# EAGLE design scenes bus (EAGLE 7.4.0)
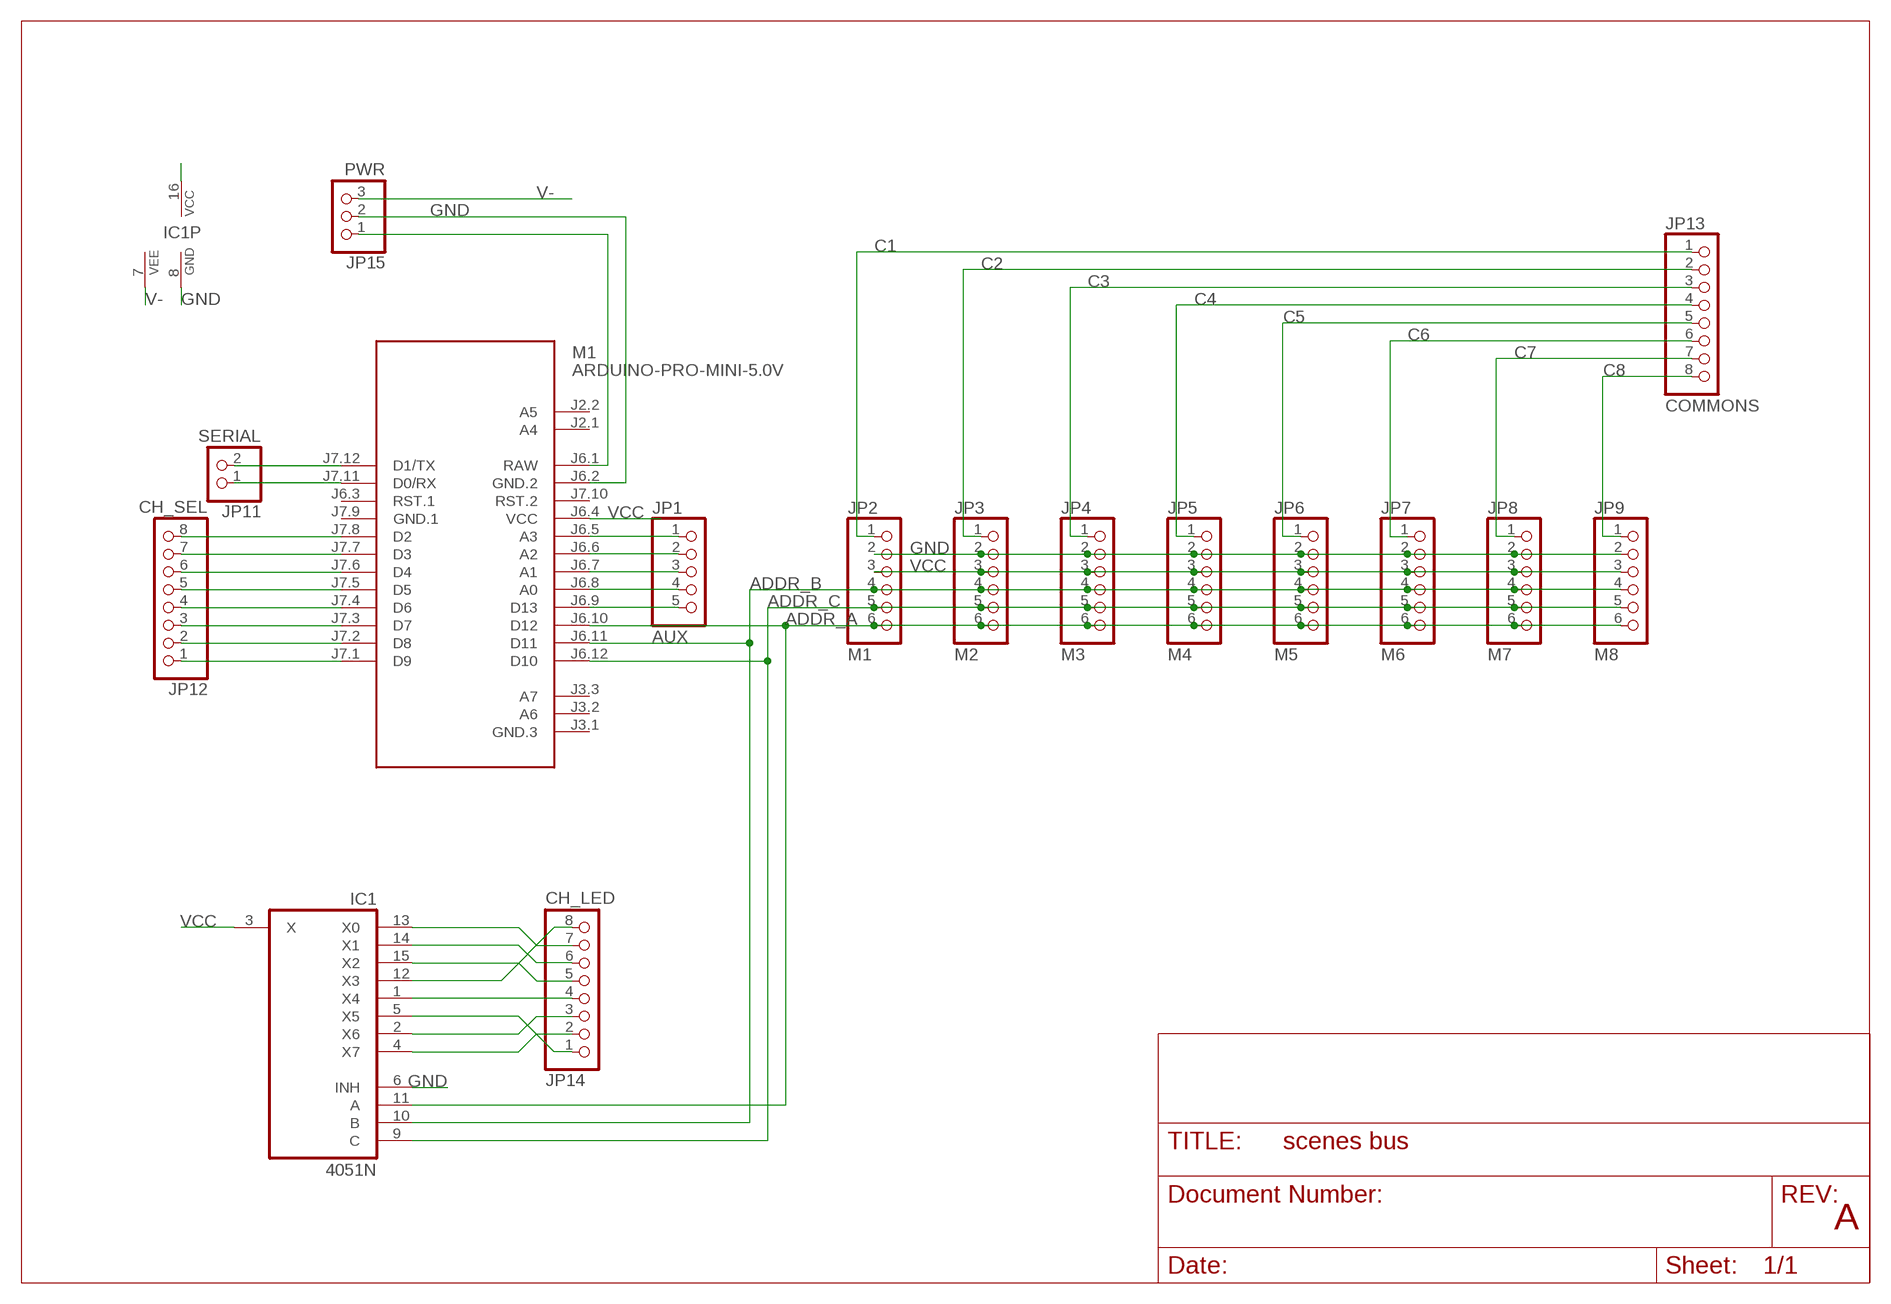
[diagram p0: schematic, sheet 1]

## Parts
IC1  4051N  [DIL16]
JP1  AUX  PINHD-1X5  [1X05]
JP2  M1  PINHD-1X6  [1X06]
JP3  M2  PINHD-1X6  [1X06]
JP4  M3  PINHD-1X6  [1X06]
JP5  M4  PINHD-1X6  [1X06]
JP6  M5  PINHD-1X6  [1X06]
JP7  M6  PINHD-1X6  [1X06]
JP8  M7  PINHD-1X6  [1X06]
JP9  M8  PINHD-1X6  [1X06]
JP11  SERIAL  PINHD-1X2  [1X02]
JP12  CH_SEL  PINHD-1X8  [1X08]
JP13  COMMONS  PINHD-1X8  [1X08]
JP14  CH_LED  PINHD-1X8  [1X08]
JP15  PWR  PINHD-1X3  [1X03]
M1  ARDUINO-PRO-MINI-5.0V  ARDUINO-PRO-MINI-5.0V#NP  [ARDUINO-PRO-MINI#NP]

## Nets
ADDR_A: IC1.11(A) JP2.6 JP3.6 JP4.6 JP5.6 JP6.6 JP7.6 JP8.6 JP9.6 M1.J6.10(D12)
ADDR_B: IC1.10(B) JP2.4 JP3.4 JP4.4 JP5.4 JP6.4 JP7.4 JP8.4 JP9.4 M1.J6.11(D11)
ADDR_C: IC1.9(C) JP2.5 JP3.5 JP4.5 JP5.5 JP6.5 JP7.5 JP8.5 JP9.5 M1.J6.12(D10)
C1: JP2.1 JP13.1
C2: JP3.1 JP13.2
C3: JP4.1 JP13.3
C4: JP5.1 JP13.4
C5: JP6.1 JP13.5
C6: JP7.1 JP13.6
C7: JP8.1 JP13.7
C8: JP9.1 JP13.8
GND: IC1.6(INH) IC1.8(GND) JP2.2 JP3.2 JP4.2 JP5.2 JP6.2 JP7.2 JP8.2 JP9.2 JP15.2 M1.J6.2(GND.2)
N$1: JP1.1 M1.J6.5(A3)
N$2: JP1.2 M1.J6.6(A2)
N$3: JP1.3 M1.J6.7(A1)
N$4: JP1.4 M1.J6.8(A0)
N$5: JP1.5 M1.J6.9(D13)
N$14: JP12.1 M1.J7.1(D9)
N$15: JP12.2 M1.J7.2(D8)
N$16: JP12.3 M1.J7.3(D7)
N$17: JP12.4 M1.J7.4(D6)
N$18: JP12.5 M1.J7.5(D5)
N$19: JP12.6 M1.J7.6(D4)
N$20: JP12.7 M1.J7.7(D3)
N$21: JP12.8 M1.J7.8(D2)
N$23: IC1.1(X4) JP14.4
N$24: IC1.2(X6) JP14.3
N$25: JP11.2 M1.J7.12(D1/TX)
N$26: JP11.1 M1.J7.11(D0/RX)
N$27: IC1.4(X7) JP14.2
N$28: IC1.5(X5) JP14.1
N$30: JP15.1 M1.J6.1(RAW)
N$31: IC1.15(X2) JP14.5
N$32: IC1.14(X1) JP14.6
N$33: IC1.13(X0) JP14.7
N$34: IC1.12(X3) JP14.8
V-: IC1.7(VEE) JP15.3
VCC: IC1.3(X) IC1.16(VCC) JP2.3 JP3.3 JP4.3 JP5.3 JP6.3 JP7.3 JP8.3 JP9.3 M1.J6.4(VCC)
Unconnected: M1.J2.1(A4) M1.J2.2(A5) M1.J3.1(GND.3) M1.J3.2(A6) M1.J3.3(A7) M1.J6.3(RST.1) M1.J7.10(RST.2)

## Notes on the sheet
- A

## Power pins joined to a net without a drawn wire
GND.1: M1.J7.9(GND.1)

## Library data of the parts
IC1 = 40xx:4051: 8-channel ANALOG MULTIPLEXER
JP1 = pinhead:PINHD-1X5: PIN HEADER
JP2-JP9 = pinhead:PINHD-1X6: PIN HEADER
JP11 = pinhead:PINHD-1X2: PIN HEADER
JP12-JP14 = pinhead:PINHD-1X8: PIN HEADER
JP15 = pinhead:PINHD-1X3: PIN HEADER
M1 = diy-modules:ARDUINO-PRO-MINI-*#NP: Arduino Pro Mini (and compatible devices) without programming pads More details available here: https://www.arduino.cc/en/Main/ArduinoBoardProMini Click here to find device on ebay.com <http://www.ebay.com/sch/arduino+pro+mini>

## Board
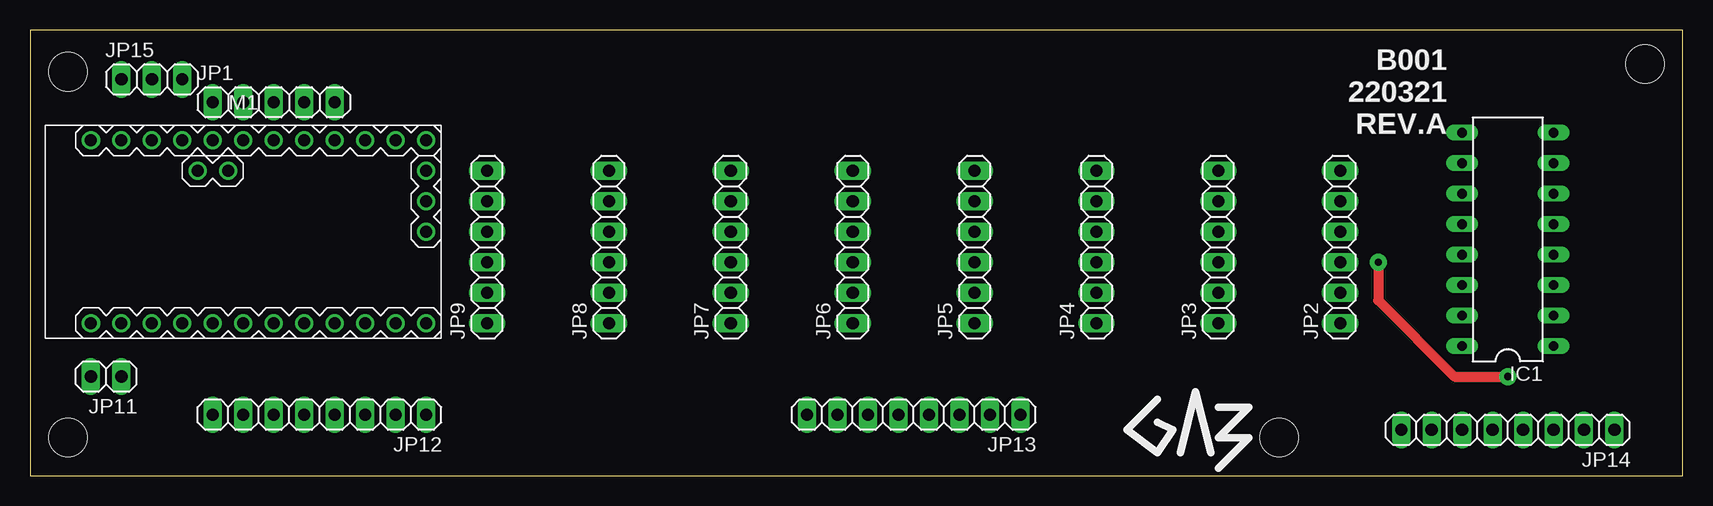
[diagram p1: board, top side]
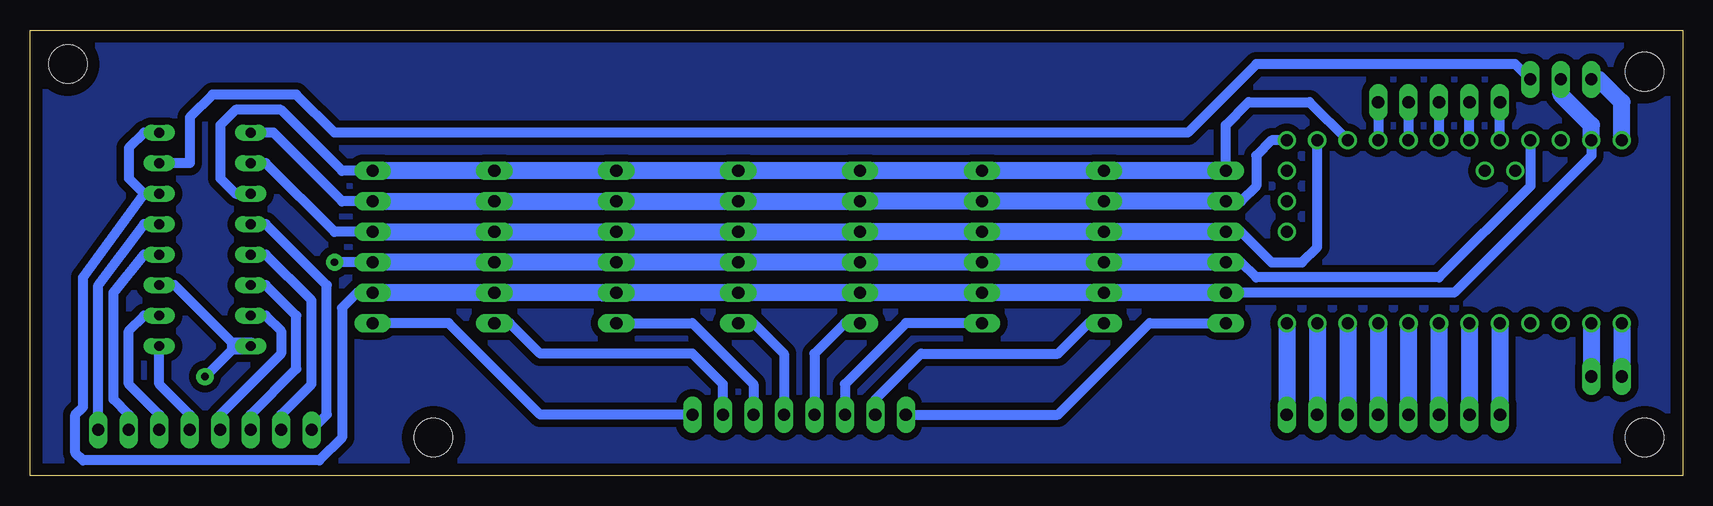
[diagram p2: board, bottom side, seen from below]

Size 137.78 x 37.13 mm. Coordinates in mm from the lower left corner, seen from the top.
Outline: 0,0 137.78,0 137.78,37.13 0,37.13 0,0
Copper layers (1*16): Top 0.035mm / dielectric 1.5mm / Bottom 0.035mm
Design rules "default": minimum track width 10mil, minimum drill 24mil, track to track 8mil, track to pad 8mil, pad to pad 8mil, via to via 8mil, smd to smd 8mil, copper to edge 40mil, drill to drill 8mil, minimum pad ring 10mil, minimum via ring 8mil, stop-mask expansion 4mil, vias tented up to drill 0mil, thermal gap 10mil
Holes 3.2 mm at 3.17,3.17 134.62,34.29 3.17,33.66 104.14,3.17

### Footprints (pad centres in the part's own frame; a part is rotated, then mirrored left to right if it is on the bottom)
DIL16 = drill 0.813 long: 1 -8.89,-3.81; 2 -6.35,-3.81; 3 -3.81,-3.81; 4 -1.27,-3.81; 5 1.27,-3.81; 6 3.81,-3.81; 7 6.35,-3.81; 8 8.89,-3.81; 9 8.89,3.81; 10 6.35,3.81; 11 3.81,3.81; 12 1.27,3.81; 13 -1.27,3.81; 14 -3.81,3.81; 15 -6.35,3.81; 16 -8.89,3.81
1X05 = drill 1.016 long: 1 -5.08,0; 2 -2.54,0; 3 0,0; 4 2.54,0; 5 5.08,0
1X06 = drill 1.016 long: 1 -6.35,0; 2 -3.81,0; 3 -1.27,0; 4 1.27,0; 5 3.81,0; 6 6.35,0
1X02 = drill 1.016 long: 1 -1.27,0; 2 1.27,0
1X08 = drill 1.016 long: 1 -8.89,0; 2 -6.35,0; 3 -3.81,0; 4 -1.27,0; 5 1.27,0; 6 3.81,0; 7 6.35,0; 8 8.89,0
1X03 = drill 1.016 long: 1 -2.54,0; 2 0,0; 3 2.54,0
ARDUINO-PRO-MINI#NP = drill 1: J2.1 -1.27,5.08; J2.2 -3.81,5.08; J3.1 15.24,0; J3.2 15.24,2.54; J3.3 15.24,5.08; J6.1 -12.7,7.62; J6.2 -10.16,7.62; J6.3 -7.62,7.62; J6.4 -5.08,7.62; J6.5 -2.54,7.62; J6.6 0,7.62; J6.7 2.54,7.62; J6.8 5.08,7.62; J6.9 7.62,7.62; J6.10 10.16,7.62; J6.11 12.7,7.62; J6.12 15.24,7.62; J7.1 15.24,-7.62; J7.2 12.7,-7.62; J7.3 10.16,-7.62; J7.4 7.62,-7.62; J7.5 5.08,-7.62; J7.6 2.54,-7.62; J7.7 0,-7.62; J7.8 -2.54,-7.62; J7.9 -5.08,-7.62; J7.10 -7.62,-7.62; J7.11 -10.16,-7.62; J7.12 -12.7,-7.62

### Placement (x,y rotation side)
IC1  123.19,19.68 90 top
JP1  20.32,31.11 0 top
JP2  109.22,19.05 90 top
JP3  99.06,19.05 90 top
JP4  88.9,19.05 90 top
JP5  78.74,19.05 90 top
JP6  68.58,19.05 90 top
JP7  58.42,19.05 90 top
JP8  48.26,19.05 90 top
JP9  38.1,19.05 90 top
JP11  6.35,8.26 180 top
JP12  24.13,5.08 180 top
JP13  73.66,5.08 180 top
JP14  123.19,3.81 180 top
JP15  10.16,33.02 0 top
M1  17.78,20.32 0 top

### Tracks (layer width: path | path; a pad name or v marks a point on that pad's centre or on a via)
ADDR_A
  Bottom 0.813: JP9.6 38.1,29.21 36.2,31.11 31.11,31.11 M1.J6.10 | JP2.6 111.76,25.4 116.84,30.48 120.65,30.48 121.92,29.21 121.92,24.77 120.65,23.5 IC1.11
  Bottom 1.422: JP9.6 JP8.6 JP7.6 JP6.6 JP5.6 JP4.6 JP3.6 JP2.6
ADDR_B
  Bottom 0.813: JP9.4 36.83,20.32 34.29,17.78 31.75,17.78 30.48,19.05 M1.J6.11 | JP2.4 112.39,20.32 118.11,26.04 IC1.10
  Bottom 1.422: JP9.4 JP8.4 JP7.4 JP6.4 JP5.4 JP4.4 JP3.4 JP2.4
ADDR_C
  Bottom 0.813: M1.J6.12 34.29,27.94 35.56,26.67 35.56,24.13 36.83,22.86 JP9.5 | JP2.5 111.76,22.86 117.47,28.57 IC1.9
  Bottom 1.422: JP9.5 JP8.5 JP7.5 JP6.5 JP5.5 JP4.5 JP3.5 JP2.5
C1
  Bottom 0.813: JP13.1 95.25,5.08 102.87,12.7 JP2.1
C2
  Bottom 0.813: JP13.2 80.01,7.62 82.55,10.16 95.25,10.16 97.79,12.7 JP3.1
C3
  Bottom 0.813: JP4.1 82.55,12.7 77.47,7.62 JP13.3
C4
  Bottom 0.813: JP5.1 77.47,12.7 74.93,10.16 JP13.4
C5
  Bottom 0.813: JP6.1 69.85,12.7 72.39,10.16 JP13.5
C6
  Bottom 0.813: JP7.1 64.77,12.7 69.85,7.62 JP13.6
C7
  Bottom 0.813: JP13.7 67.31,6.35 63.5,10.16 52.07,10.16 49.53,12.7 JP8.1
C8
  Bottom 0.813: JP13.8 52.07,5.08 44.45,12.7 JP9.1
GND
  Bottom 0.813: M1.J6.2 7.62,26.67 19.05,15.24 JP9.2 | IC1.8 128.27,28.57 129.54,27.3 129.54,24.77 128.27,23.5 | 128.27,23.5 IC1.6 | JP2.2 110.49,15.24 111.76,13.97 111.76,3.17 113.67,1.27 133.35,1.27 133.99,1.91 133.99,5.08 133.35,5.71 133.35,16.51 128.27,23.5
  Bottom 1.422: JP9.2 JP8.2 JP7.2 JP6.2 JP5.2 JP4.2 | 90.17,15.24 JP4.2 | JP4.2 JP3.2 JP2.2 | M1.J6.2 7.62,29.21 10.16,31.75 JP15.2
N$1
  Bottom 0.813: M1.J6.5 JP1.1
N$2
  Bottom 0.813: M1.J6.6 JP1.2
N$3
  Bottom 0.813: JP1.3 M1.J6.7
N$4
  Bottom 0.813: JP1.4 M1.J6.8
N$5
  Bottom 0.813: JP1.5 M1.J6.9
N$6
  pour Bottom (isolate 0.61): 0,36.83 137.79,36.83 137.79,0 0,0
N$14
  Bottom 1.422: M1.J7.1 JP12.1
N$15
  Bottom 1.422: M1.J7.2 JP12.2
N$16
  Bottom 1.422: M1.J7.3 JP12.3
N$17
  Bottom 1.422: M1.J7.4 JP12.4
N$18
  Bottom 1.422: M1.J7.5 JP12.5
N$19
  Bottom 1.422: M1.J7.6 JP12.6
N$20
  Bottom 1.422: M1.J7.7 JP12.7
N$21
  Bottom 1.422: M1.J7.8 JP12.8
N$23
  Bottom 0.813: JP14.4 124.46,5.08 127,7.62 IC1.1
N$24
  Bottom 0.813: JP14.3 127,5.08 129.54,7.62 129.54,12.06 128.27,13.34 IC1.2
N$25
  Bottom 1.422: M1.J7.12 JP11.2
N$26
  Bottom 1.422: M1.J7.11 JP11.1
N$27
  Bottom 0.813: JP14.2 129.54,5.08 130.81,6.35 130.81,15.24 128.27,18.41 IC1.4
N$28
  Bottom 0.813: JP14.1 132.08,15.88 128.27,20.95 IC1.5
N$30
  Bottom 1.422: M1.J6.1 5.08,31.11 6.99,33.02 JP15.1
N$31
  Bottom 0.813: IC1.15 118.11,13.34 116.84,12.06 116.84,10.16 121.92,5.08 JP14.5
N$32
  Bottom 0.813: JP14.6 119.38,5.08 115.57,8.89 115.57,13.34 118.11,15.88 IC1.14
N$33
  Bottom 0.813: JP14.7 116.84,5.08 114.3,7.62 114.3,14.61 118.11,18.41 IC1.13
N$34
  Bottom 0.813: JP14.8 113.03,5.08 113.03,15.88 118.11,20.95 IC1.12
V-
  Bottom 0.813: JP15.3 13.97,34.29 35.56,34.29 41.27,28.57 112.39,28.57 115.57,31.75 122.56,31.75 124.46,29.84 124.46,26.04 IC1.7
VCC  (via drill 0.6 pad 1.42)
  Top 0.813: v112.39,17.78 112.39,14.61 118.75,8.26 v123.19,8.26
  Bottom 0.813: IC1.3 125.73,15.88 120.65,10.79 v123.19,8.26 | M1.J6.4 12.7,24.13 20.32,16.51 35.56,16.51 36.83,17.78 JP9.3 | JP2.3 v112.39,17.78
  Bottom 1.422: JP9.3 JP8.3 JP7.3 JP6.3 JP5.3 JP4.3 JP3.3 JP2.3 | IC1.16 120.65,10.79

### Text on the board
tPlace: B001 / 220321 / REV.A
tValues: SCENES SELECTOR